# EAGLE design base (EAGLE 6.5.0)
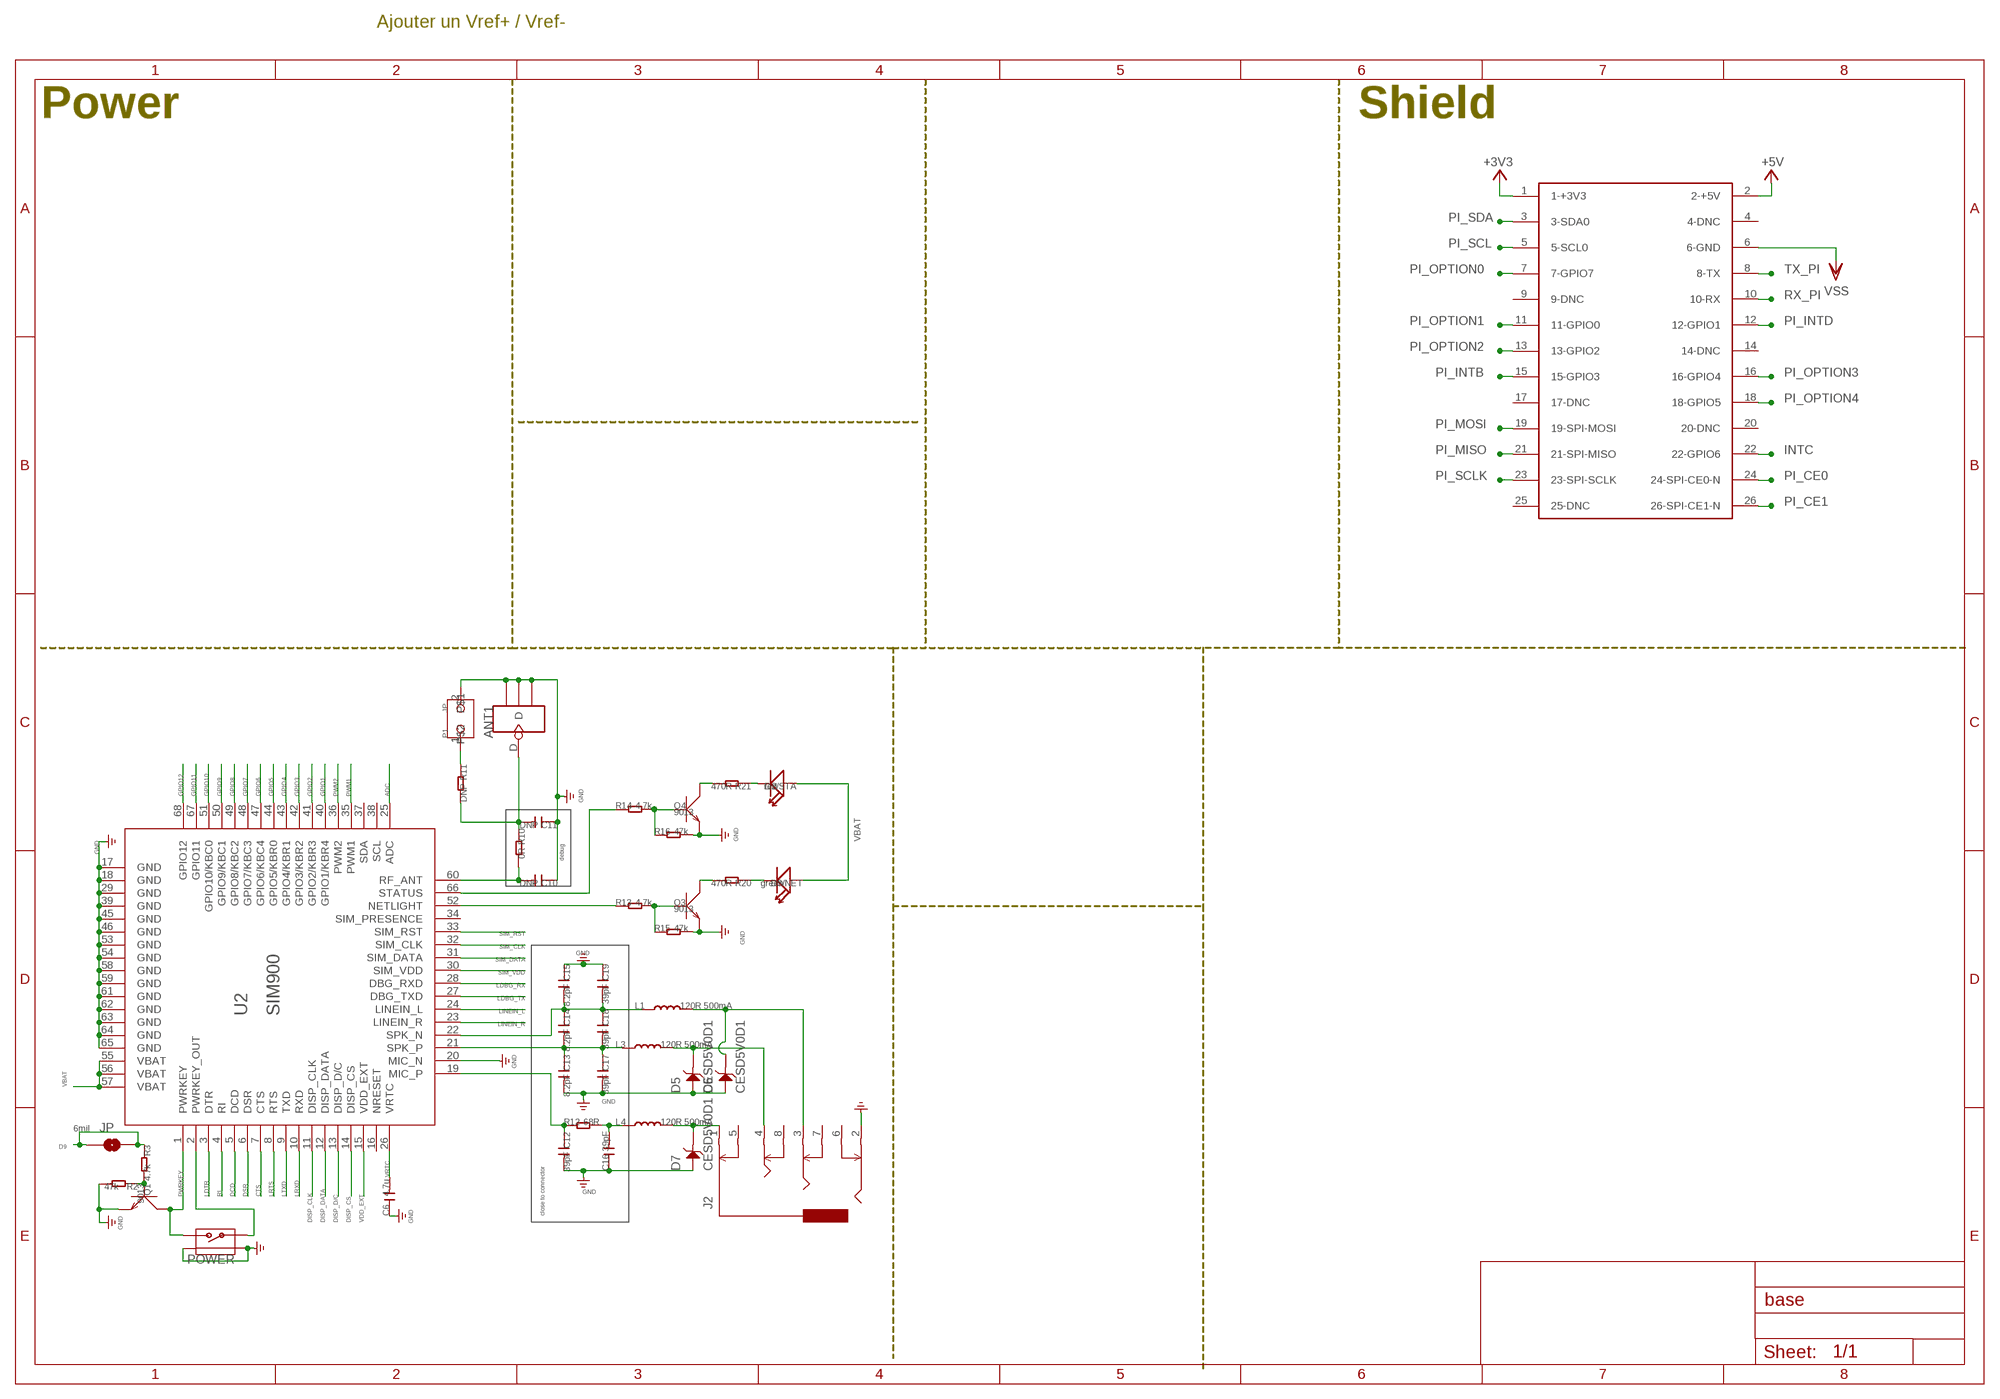
[diagram p0: schematic, sheet 1]

## Parts
ANT1  ANTENNA-U-FL  [4P-U-FL]
C6  4.7u  C-0805  [C0805]
C10  DNP  C-0603  [C0603]
C11  DNP  C-0603  [C0603]
C12  39pF  C-0603  [C0603]
C13  8.2pF  C-0603  [C0603]
C14  8.2pF  C-0603  [C0603]
C15  8.2pF  C-0603  [C0603]
C16  39pF  C-0603  [C0603]
C17  39pF  C-0603  [C0603]
C18  39pF  C-0603  [C0603]
C19  39pF  C-0603  [C0603]
D2/STA  red  LED'0603'  [LED-0603]
D3/NET  green  LED'0603'  [LED-0603]
D5  CESD5V0D1  D-ESD  [SOD123-2.7X1.6]
D6  CESD5V0D1  D-ESD  [SOD123-2.7X1.6]
D7  CESD5V0D1  D-ESD  [SOD123-2.7X1.6]
J2  AUDIO-8P'PJ-3536-L6S'  [8P-3.5-SMD]
JP  PAD-SOLDERJUMPERNC  [2P-SMD-3.3X2]
L1  120R 500mA  L'0603'  [L0603]
L3  120R 500mA  L'0603'  [L0603]
L4  120R 500mA  L'0603'  [L0603]
P1  JP  [JP]
POWER  BUTTON-4P-REINFORCE'TS-118E'  [4P-SMD-7X3.5X3.5H]
Q1  9013  TRANSISTOR-NPN-SOT23  [SOT23]
Q3  9013  TRANSISTOR-NPN-SOT23  [SOT23]
Q4  9013  TRANSISTOR-NPN-SOT23  [SOT23]
R2  47k  R-0603  [R0603]
R3  4.7k  R-0603  [R0603]
R10  0R  R-0603  [R0603]
R11  DNP  R-0603  [R0603]
R12  68R  R-0603  [R0603]
R13  4.7k  R-0603  [R0603]
R14  4.7k  R-0603  [R0603]
R15  47k  R-0603  [R0603]
R16  47k  R-0603  [R0603]
R20  470R  R-0603  [R0603]
R21  470R  R-0603  [R0603]
U2  SIM900  [SIM900]
U$3  RASPBERRY-PILIGHT-HOLE  [RASPBERRY-PI-LIGHT-HOLE]

## Nets
+3V3: U$3.1(1-+3V3)
+5V: U$3.2(2-+5V)
ADC: U2.25(ADC)
CTS: U2.7(CTS)
D9: JP.1 JP.2 R3.1
DCD: U2.5(DCD)
DISP_CLK: U2.11(DISP_CLK)
DISP_CS: U2.14(DISP_CS)
DISP_D/C: U2.13(DISP_D/C)
DISP_DATA: U2.12(DISP_DATA)
DSR: U2.6(DSR)
GND: ANT1.GND1 ANT1.GND2 ANT1.GND3 C6.1 C10.1 C11.1 C12.2 C13.2 C15.1 C16.1 C17.2 C19.1 D5.1 D6.1 D7.1 J2.2 P1.2 POWER.S1 POWER.S2 Q1.2(E) Q3.2(E) Q4.2(E) R2.2 R15.2 R16.2 U2.17(GND) U2.18(GND) U2.20(MIC_N) U2.29(GND) U2.39(GND) U2.45(GND) U2.46(GND) U2.53(GND) U2.54(GND) U2.58(GND) U2.59(GND) U2.61(GND) U2.62(GND) U2.63(GND) U2.64(GND) U2.65(GND)
GPIO1: U2.40(GPIO1/KBR4)
GPIO2: U2.41(GPIO2/KBR3)
GPIO3: U2.42(GPIO3/KBR2)
GPIO4: U2.43(GPIO4/KBR1)
GPIO5: U2.44(GPIO5/KBR0)
GPIO6: U2.47(GPIO6/KBC4)
GPIO7: U2.48(GPIO7/KBC3)
GPIO8: U2.49(GPIO8/KBC2)
GPIO9: U2.50(GPIO9/KBC1)
GPIO10: U2.51(GPIO10/KBC0)
GPIO11: U2.67(GPIO11)
GPIO12: U2.68(GPIO12)
INTC: U$3.22(22-GPIO6)
LDBG_RX: U2.28(DBG_RXD)
LDBG_TX: U2.27(DBG_TXD)
LDTR: U2.3(DTR)
LINEIN_L: U2.24(LINEIN_L)
LINEIN_R: U2.23(LINEIN_R)
LRTS: U2.8(RTS)
LRXD: U2.10(RXD)
LTXD: U2.9(TXD)
N$1: D2/STA.- R21.1
N$2: C10.2 R10.2 U2.60(RF_ANT)
N$3: Q3.3(C) R20.2
N$7: D3/NET.- R20.1
N$8: Q3.1(B) R13.2 R15.1
N$10: R13.1 U2.52(NETLIGHT)
N$11: POWER.1 U2.2(PWRKEY_OUT)
N$13: C12.1 R12.1 U2.19(MIC_P)
N$15: C13.1 C14.2 C17.1 C18.2 L3.1 U2.21(SPK_P)
N$16: Q4.3(C) R21.2
N$18: Q4.1(B) R14.2 R16.1
N$19: C14.1 C15.2 C18.1 C19.2 L1.1 U2.22(SPK_N)
N$20: R14.1 U2.66(STATUS)
N$21: ANT1.D C11.2 R10.1 R11.2
N$30: C16.2 L4.1 R12.2
N$36: Q1.1(B) R2.1 R3.2
N$45: D7.2 J2.1 L4.2
N$48: D5.2 J2.4 L3.2
N$51: D6.2 J2.3 L1.2
N$52: P1.1 R11.1
PI_CE0: U$3.24(24-SPI-CE0-N)
PI_CE1: U$3.26(26-SPI-CE1-N)
PI_INTB: U$3.15(15-GPIO3)
PI_INTD: U$3.12(12-GPIO1)
PI_MISO: U$3.21(21-SPI-MISO)
PI_MOSI: U$3.19(19-SPI-MOSI)
PI_OPTION0: U$3.7(7-GPIO7)
PI_OPTION1: U$3.11(11-GPIO0)
PI_OPTION2: U$3.13(13-GPIO2)
PI_OPTION3: U$3.16(16-GPIO4)
PI_OPTION4: U$3.18(18-GPIO5)
PI_SCL: U$3.5(5-SCL0)
PI_SCLK: U$3.23(23-SPI-SCLK)
PI_SDA: U$3.3(3-SDA0)
PWM1: U2.35(PWM1)
PWM2: U2.36(PWM2)
PWRKEY: POWER.2 Q1.3(C) U2.1(PWRKEY)
RI: U2.4(RI)
RX_PI: U$3.10(10-RX)
SIM_CLK: U2.32(SIM_CLK)
SIM_DATA: U2.31(SIM_DATA)
SIM_RST: U2.33(SIM_RST)
SIM_VDD: U2.30(SIM_VDD)
TX_PI: U$3.8(8-TX)
VBAT: D2/STA.+ D3/NET.+ U2.55(VBAT) U2.56(VBAT) U2.57(VBAT)
VDD_EXT: U2.15(VDD_EXT)
VRTC: C6.2 U2.26(VRTC)
VSS: U$3.6(6-GND)
Unconnected: J2.5 J2.6 J2.7 J2.8 U2.16(NRESET) U2.34(SIM_PRESENCE) U2.37(SDA) U2.38(SCL) U$3.4(4-DNC) U$3.9(9-DNC) U$3.14(14-DNC) U$3.17(17-DNC) U$3.20(20-DNC) U$3.25(25-DNC)

## Notes on the sheet
- Ajouter un Vref+ / Vref-
- Power | Shield
- debug
- 6mil
- close to connector

## Library data of the parts
ANT1 = Connector:ANTENNA-U-FL
C6 C10-C19 = Discrete:C*: Ceramic Capacitors
D2/STA D3/NET = Discrete:LED*
D5-D7 = template:D-ESD: Diodes for Protectiong against ESD
J2 = template:AUDIO-8P
JP = Discrete:PAD-SOLDERJUMPER: Solder Jumper Standard SMD solder jumper. Used to automate production. Two varients : Normally Open and Normally Closed are the same, but have different paste layers. NC will have a large amount of paste and should jumper during reflow.
L1 L3 L4 = Discrete:L*
P1 = mySeeed:JP
POWER = Discrete:BUTTON-4P-REINFORCE: TS-1188E http://www.best-dz.com/?thread-374-2.html
Q1 Q3 Q4 = Discrete:TRANSISTOR-NPN*: NPN audion
R2 R3 R10-R16 R20 R21 = Discrete:R*
U2 = ICs_v54:SIM900
U$3 = RaspberryPi:RASPBERRY-PI: Raspberry Pi Board <http://www.raspberrypi.org/> Jacques Lagnel V1.0 (beta) 2012 Board dimension: Forum 3D model <http://www.raspberrypi.org/forum/general-discussion/mechanical-profile-3d-models?value=3d%20model&type=1&include=1&search=1&ret=all> The GPIO Connector (P1): http://elinux.org/RPi_Low-level_peripherals

## Net classes
0 default: clearance 0.152 mm

## Board
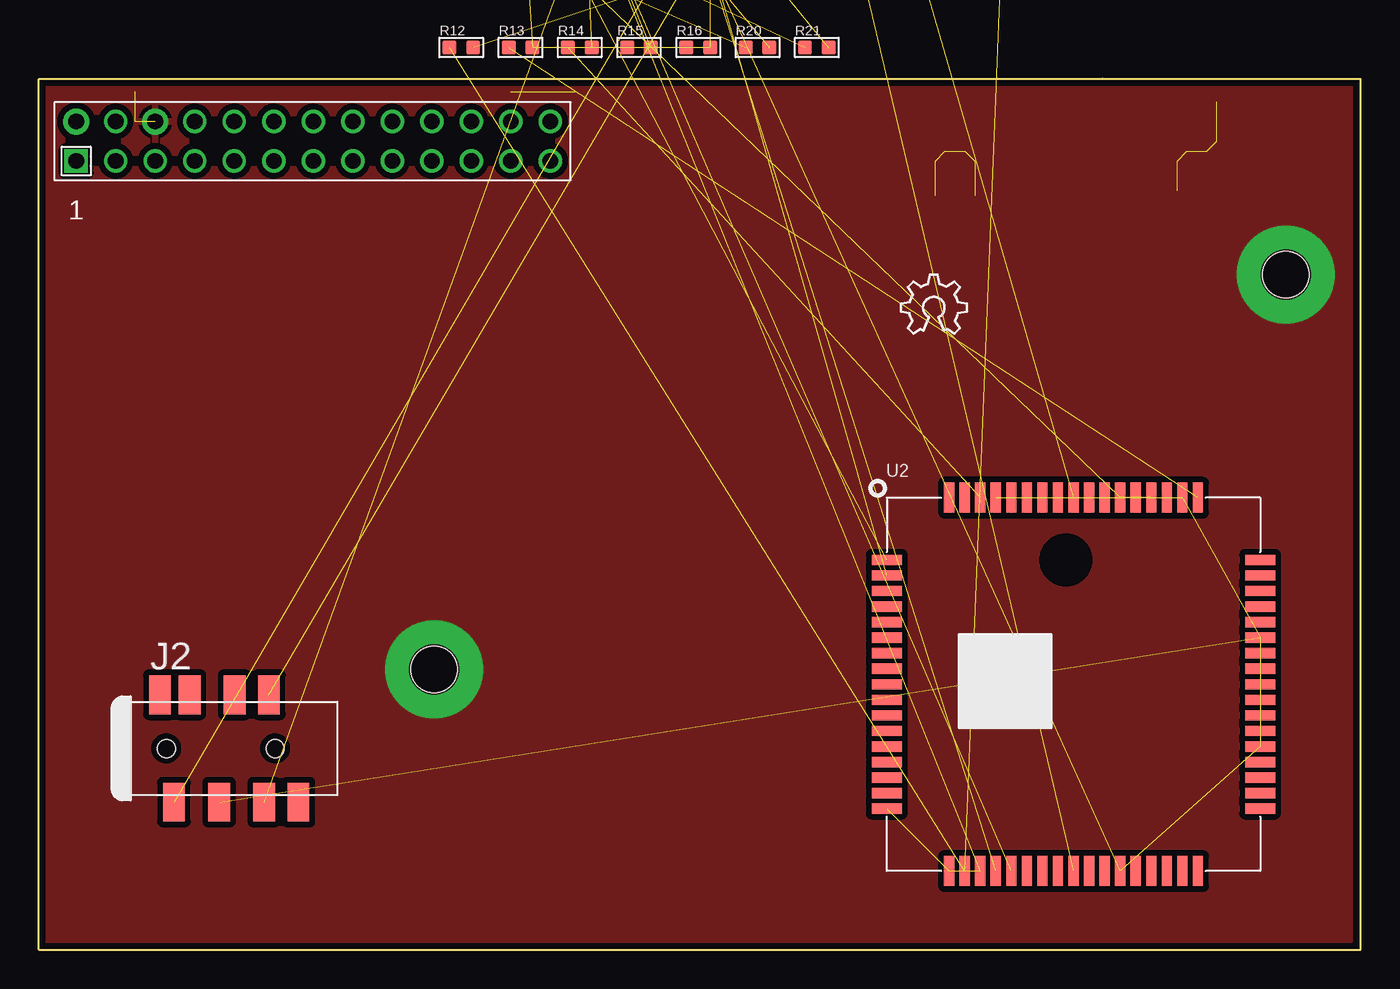
[diagram p1: board, top side]
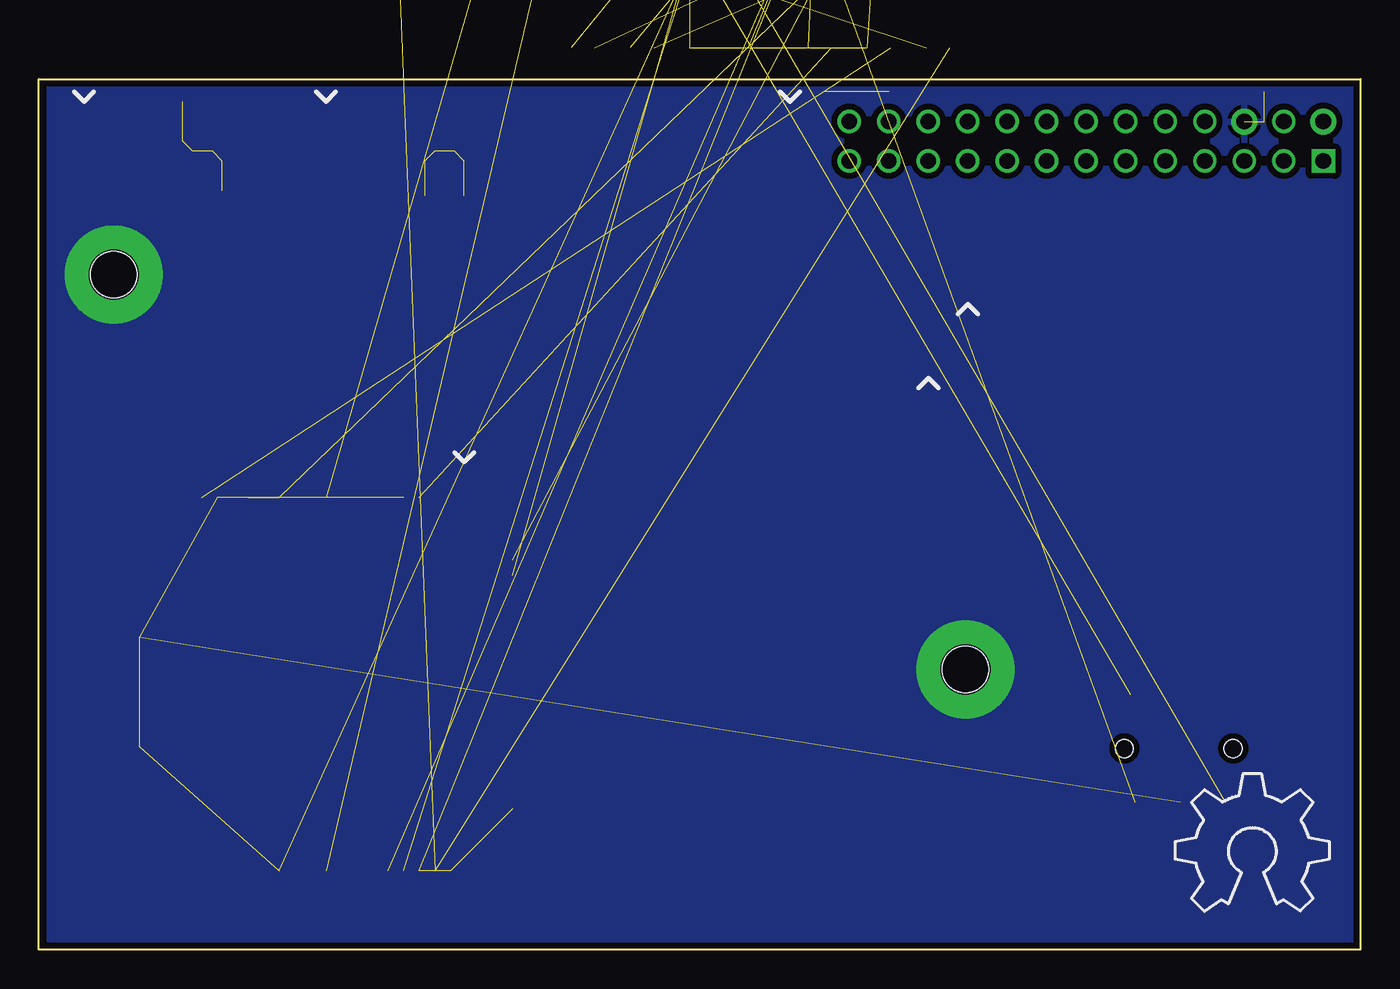
[diagram p2: board, bottom side, seen from below]

Size 85 x 56 mm. Coordinates in mm from the lower left corner, seen from the top.
Copper layers (1*16): Top 0.035mm / dielectric 1.5mm / Bottom 0.035mm
Design rules "Fusion_eagle_rule_v1.1": minimum track width 6mil, minimum drill 12mil, track to track 6mil, track to pad 6mil, pad to pad 6mil, via to via 6mil, smd to smd 0mil, copper to edge 10mil, drill to drill 10mil, minimum pad ring 10mil, minimum via ring 6mil, stop-mask expansion 2mil, vias tented up to drill 100mil, thermal gap 10mil

### Footprints (pad centres in the part's own frame; a part is rotated, then mirrored left to right if it is on the bottom)
4P-U-FL = smd 1.016 x 1.016: D -1.524,0; GND3 1.524,0 | smd 2.286 x 0.762: GND1 0,1.397; GND2 0,-1.397
C0805 = smd 1.016 x 1.397: 1 -0.889,0; 2 0.889,0
C0603 = smd 0.889 x 0.889: 1 -0.762,0; 2 0.762,0
LED-0603 = smd 0.762 x 0.889: + -0.762,0; - 0.762,0
SOD123-2.7X1.6 = smd 1.2 x 1.02: 1 -1.635,0; 2 1.635,0
8P-3.5-SMD = smd 1.4 x 2.5: 1 2.8,-3.45; 2 5.7,-3.45; 3 8.6,-3.45; 4 8.9,3.45; 5 1.9,3.45; 6 3.8,3.45; 7 6.7,3.45; 8 10.8,-3.45 | hole 1.149: 2.3,0; 9.3,0
2P-SMD-3.3X2 = smd 1.168 x 1.6: 1 -0.762,0; 2 0.762,0
L0603 = smd 0.889 x 0.889: 1 -0.762,0; 2 0.762,0
JP = smd 1.27 x 2.54: 1 -0.635,0; 2 0.635,0
4P-SMD-7X3.5X3.5H = smd 1.143 x 1.524: 1 -2.159,1.524; 2 2.159,1.524 | smd 1.778 x 1.016: S1 -3.556,-0.508; S2 3.556,-0.508 | hole 0.95: -1.15,0; 1.15,0
SOT23 = smd 1.016 x 1.143: 1 -0.95,-1.016; 2 0.95,-1.016; 3 0,1.016
R0603 = smd 0.889 x 0.889: 1 -0.762,0; 2 0.762,0
SIM900 = smd 1.93 x 0.66: 1 -12,8; 2 -12,7; 3 -12,6; 4 -12,5; 5 -12,4; 6 -12,3; 7 -12,2; 8 -12,1; 9 -12,0; 10 -12,-1; 11 -12,-2; 12 -12,-3; 13 -12,-4; 14 -12,-5; 15 -12,-6; 16 -12,-7; 17 -12,-8; 35 12,-8; 36 12,-7; 37 12,-6; 38 12,-5; 39 12,-4; 40 12,-3; 41 12,-2; 42 12,-1; 43 12,0; 44 12,1; 45 12,2; 46 12,3; 47 12,4; 48 12,5; 49 12,6; 50 12,7; 51 12,8 | smd 0.66 x 1.93: 18 -8,-12; 19 -7,-12; 20 -6,-12; 21 -5,-12; 22 -4,-12; 23 -3,-12; 24 -2,-12; 25 -1,-12; 26 0,-12; 27 1,-12; 28 2,-12; 29 3,-12; 30 4,-12; 31 5,-12; 32 6,-12; 33 7,-12; 34 8,-12; 52 8,12; 53 7,12; 54 6,12; 55 5,12; 56 4,12; 57 3,12; 58 2,12; 59 1,12; 60 0,12; 61 -1,12; 62 -2,12; 63 -3,12; 64 -4,12; 65 -5,12; 66 -6,12; 67 -7,12; 68 -8,12
RASPBERRY-PI-LIGHT-HOLE = drill 1 square: 1 -39.37,22.86 | drill 1 pad 1.676: 2 -39.37,25.4; 6 -34.29,25.4 | drill 1: 3 -36.83,22.86; 4 -36.83,25.4; 5 -34.29,22.86; 7 -31.75,22.86; 8 -31.75,25.4; 9 -29.21,22.86; 10 -29.21,25.4; 11 -26.67,22.86; 12 -26.67,25.4; 13 -24.13,22.86; 14 -24.13,25.4; 15 -21.59,22.86; 16 -21.59,25.4; 17 -19.05,22.86; 18 -19.05,25.4; 19 -16.51,22.86; 20 -16.51,25.4; 21 -13.97,22.86; 22 -13.97,25.4; 23 -11.43,22.86; 24 -11.43,25.4; 25 -8.89,22.86; 26 -8.89,25.4 | hole 3: -16.351,-9.842; 38.417,15.557

### Placement (x,y rotation side)
ANT1  54.47,70.09 0 top  (outside the outline)
C6  50.34,70.09 0 top  (outside the outline)
C10  55.11,65.97 0 top  (outside the outline)
C11  58.92,65.97 0 top  (outside the outline)
C12  62.73,65.97 0 top  (outside the outline)
C13  27.17,61.84 0 top  (outside the outline)
C14  30.98,61.84 0 top  (outside the outline)
C15  34.79,61.84 0 top  (outside the outline)
C16  38.6,61.84 0 top  (outside the outline)
C17  42.41,61.84 0 top  (outside the outline)
C18  46.22,61.84 0 top  (outside the outline)
C19  50.03,61.84 0 top  (outside the outline)
D2/STA  32.25,65.65 0 top  (outside the outline)
D3/NET  27.17,65.65 0 top  (outside the outline)
D5  27.17,70.09 0 top  (outside the outline)
D6  34.79,70.09 0 top  (outside the outline)
D7  42.41,70.09 0 top  (outside the outline)
J2  5.89,12.94 0 top
JP  64.63,74.86 0 top  (outside the outline)
L1  37.01,65.97 0 top  (outside the outline)
L3  43.04,65.97 0 top  (outside the outline)
L4  49.07,65.97 0 top  (outside the outline)
P1  60.5,69.14 0 top  (outside the outline)
POWER  41.77,74.86 0 top  (outside the outline)
Q1  27.48,75.49 0 top  (outside the outline)
Q3  31.61,75.49 0 top  (outside the outline)
Q4  35.74,75.49 0 top  (outside the outline)
R2  53.84,61.84 0 top  (outside the outline)
R3  57.65,61.84 0 top  (outside the outline)
R10  61.46,61.84 0 top  (outside the outline)
R11  65.27,61.84 0 top  (outside the outline)
R12  27.17,58.03 0 top
R13  30.98,58.03 0 top
R14  34.79,58.03 0 top
R15  38.6,58.03 0 top
R16  42.41,58.03 0 top
R20  46.22,58.03 0 top
R21  50.03,58.03 0 top
U2  66.53,17.07 0 top
U$2  [OSHW_8X350_NOTEXT]  11.93,2.46 0 bottom
U$3  41.77,27.86 0 top
U$5  [OSHW_6X150_NOTEXT]  55.42,39.61 0 top

### Tracks (layer width: path | path; a pad name or v marks a point on that pad's centre or on a via)
D9  (2 unrouted)
GND  (40 unrouted)
N$1  (1 unrouted)
N$2  (2 unrouted)
N$3  (1 unrouted)
N$7  (1 unrouted)
N$8  (2 unrouted)
N$10  (1 unrouted)
N$11  (1 unrouted)
N$13  (2 unrouted)
N$15  (5 unrouted)
N$16  (1 unrouted)
N$18  (2 unrouted)
N$19  (5 unrouted)
N$20  (1 unrouted)
N$21  (3 unrouted)
N$30  (2 unrouted)
N$36  (2 unrouted)
N$45  (2 unrouted)
N$48  (2 unrouted)
N$51  (2 unrouted)
N$52  (1 unrouted)
PWRKEY  (2 unrouted)
VBAT  (4 unrouted)
VRTC  (1 unrouted)
VSS  (via drill 3.2 pad 6.3)  (13 unrouted)
  other vias: 80.19,43.42 25.42,18.02
  pour Top (isolate 0.381): 0.5,55.49 84.31,55.49 84.31,0.56 0.5,0.56
  pour Bottom (isolate 0.381): 0.5,55.49 84.31,55.49 84.31,0.56 0.5,0.56